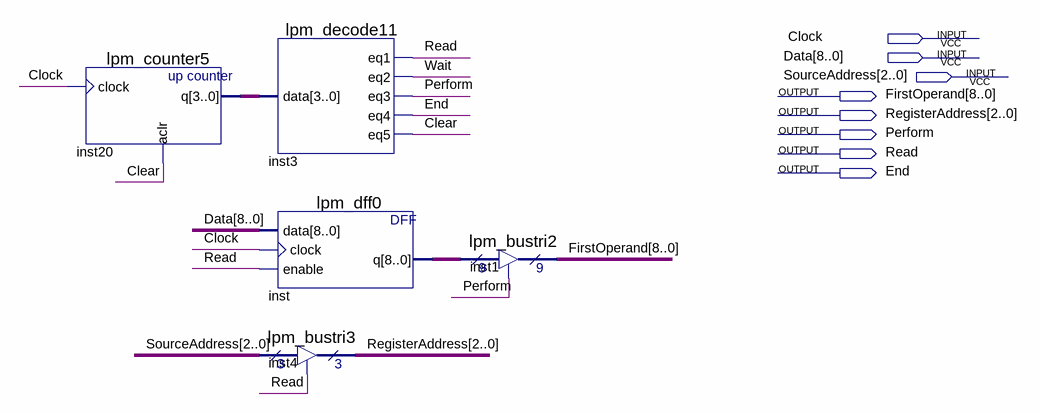
[diagram p0: schematic sheet]
// Quartus schematic NotBlock.bdf as structural Verilog: 5 symbols, 8 pins
module NotBlock (
  input  Clock,
  input  [8:0] Data,
  input  [2:0] SourceAddress,
  output [8:0] FirstOperand,
  output [2:0] RegisterAddress,
  output Perform,
  output Read,
  output End
);

  wire Clear, Wait;
  wire [3:0] inst20_q;
  wire [8:0] inst_q;

  lpm_counter5 inst20 (.clock(Clock), .aclr(Clear), .q(inst20_q));
  lpm_decode11 inst3 (.data(inst20_q), .eq1(Read), .eq2(Wait), .eq3(Perform), .eq4(End), .eq5(Clear));
  lpm_dff0 inst (.data(Data), .clock(Clock), .enable(Read), .q(inst_q));
  lpm_bustri3 inst4 (.enabledt(Read), .data(SourceAddress), .tridata(RegisterAddress));
  lpm_bustri2 inst1 (.enabledt(Perform), .data(inst_q), .tridata(FirstOperand));
endmodule
